# Altium schematic sheet SENSE DAC - 8CH.SchDoc
size B; Organization: Altium Limited; Address1: L3, 12a Rodborough Rd; Address2: Frenchs Forest; Address3: NSW; Address4: Australia 2086
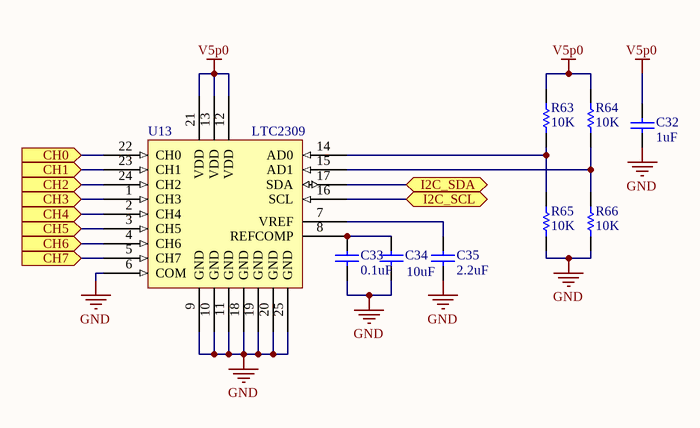
[diagram p0: SENSE DAC - 8CH.SchDoc]

## Parts
C32  value 1uF  [CAPC01005(0402)22_N]  (hidden comment: CAP, 0402, 1uF)
C33  value 0.1uF  [CAPC01005(0402)22_N]  (hidden comment: CAP, 0402, 0.1uF)
C34  value 10uF  [CAPC0805(2012)130_N]  (hidden comment: CAP, 0805, 10uF)
C35  value 2.2uF  [CAPC01005(0402)22_N]  (hidden comment: CAP, 0402, 2.2uF)
R63  10K  [RES, 0603]
R64  10K  [RES, 0603]
R65  10K  [RES, 0603]
R66  10K  [RES, 0603]
U13  LTC2309  [QFN50P400X400X80-24N]

## Ports
CH0 (in), CH1 (in), CH2 (in), CH3 (in), CH4 (in), CH5 (in), CH6 (in), CH7 (in), I2C_SCL (bidir), I2C_SDA (bidir)

## Nets
GND: C32.1 C33.1 C34.1 C35.1 R65.2 R66.2 U13.6(COM) U13.9(GND) U13.10(GND) U13.11(GND) U13.18(GND) U13.19(GND) U13.20(GND) U13.25(GND)
V5p0: C32.2 R63.1 R64.1 U13.12(VDD) U13.13(VDD) U13.21(VDD)
CH0: U13.22(CH0) ; port CH0
CH1: U13.23(CH1) ; port CH1
CH2: U13.24(CH2) ; port CH2
CH3: U13.1(CH3) ; port CH3
CH4: U13.2(CH4) ; port CH4
CH5: U13.3(CH5) ; port CH5
CH6: U13.4(CH6) ; port CH6
CH7: U13.5(CH7) ; port CH7
I2C_SCL: U13.16(SCL) ; port I2C_SCL
I2C_SDA: U13.17(SDA) ; port I2C_SDA
NetC33_2: C33.2 C34.2 U13.8(REFCOMP)
NetC35_2: C35.2 U13.7(VREF)
NetR63_2: R63.2 R65.1 U13.14(AD0)
NetR64_2: R64.2 R66.1 U13.15(AD1)

## Notes on the sheet
- Title
- Size:
- Date:
- B
- Number:
- Time:
- Revision:
- Sheet
- of
- File:

## Library data of the parts
R63-R66 = RES_0603_10K: Resistor, 0603, 1/10W, 10K ohm; Manufacturer: Panasonic Electronic Components; Manufacturer Part Number: ERJ-3EKF1002V; Description: RES 10K OHM 1/10W 1% 0603 SMD; Tolerance: ±1%; Power (Watts): 0.1W, 1/10W; Temperature Coefficient: ±100ppm/°C; Supplier 1: Digi-Key; RoHS: RoHS Compliant; Category: Resistors; Stock 1: 4631019; Pricing 1: 1=0.1, 50=0.0138, 100=0.0105, 250=0.0078, 500=0.00576, 1000=0.00384 (USD); Packaging: Cut Tape (CT); Resistance (Ohms): 10k; Composition: Thick Film; Features: -; Package / Case: 0603 (1608 Metric); Supplier Device Package: 0603; Size / Dimension: 0.063" L x 0.031" W (1.60mm x 0.80mm); Height: 0.022" (0.55mm); Number of Terminations: 2; ComponentLink1URL: http://industrial.panasonic.com/www-cgi/jvcr13pz.cgi?E+PZ+3+AOA0002+ERJ3EKF1002V+7+WW; ComponentLink1Description: http://industrial.panasonic.com/www-cgi/jvcr13pz.cgi?E+PZ+3+AOA0002+ERJ3EKF1002V+7+WW; Supplier Part Number 1: P10.0KHCT-ND
U13 = LTC2309: 8-Channel, 12-Bit SAR ADC with I2C Interface; Manufacturer: Linear Technology; Manufacturer Part Number: LTC2309CUF#PBF; Number of Bits: 12; Sampling Rate (Per Second): 14k; Data Interface: I²C, Serial; Number of Converters: 1; Voltage Supply Source: Single Supply; Number of Inputs and Type: 8 Single-Ended, Unipolar; 8 Single-Ended, Bipolar; 4 Differential, Unipolar; 4 Differential, Bipolar; Description: IC ADC 12BIT SAR 24-QFN; Packaging: Tube; Operating Temperature: 0°C ~ 70°C; Mounting Type: Surface Mount; Package / Case: 24-WFQFN Exposed Pad; Supplier Device Package: 24-QFN Exposed Pad (4x4); ComponentLink1URL: http://www.linear.com/docs/25786; ComponentLink1Description: http://www.linear.com/docs/25786; Supplier 1: Digi-Key; Supplier Part Number 1: LTC2309CUF#PBF-ND; RoHS: RoHS Compliant; Category: Integrated Circuits (ICs); Stock 1: 532; Pricing 1: 1=6.31, 25=5.27, 100=4.34 (USD)
C32 = CAP, 0402, 1uF: Supplier 1: Digi-Key; Supplier Part Number 1: 587-3245-1-ND
C33 = CAP, 0402, 0.1uF: Supplier 1: Digi-Key; Supplier Part Number 1: 587-1456-2-ND
C34 = CAP, 0805, 10uF: Supplier 1: Digi-Key; Supplier Part Number 1: 587-2985-1-ND
C35 = CAP, 0402, 2.2uF: Supplier 1: Digi-Key; Supplier Part Number 1: 587-3245-1-ND